# Altium project PLC1.PrjPcb (part 2 of 2)
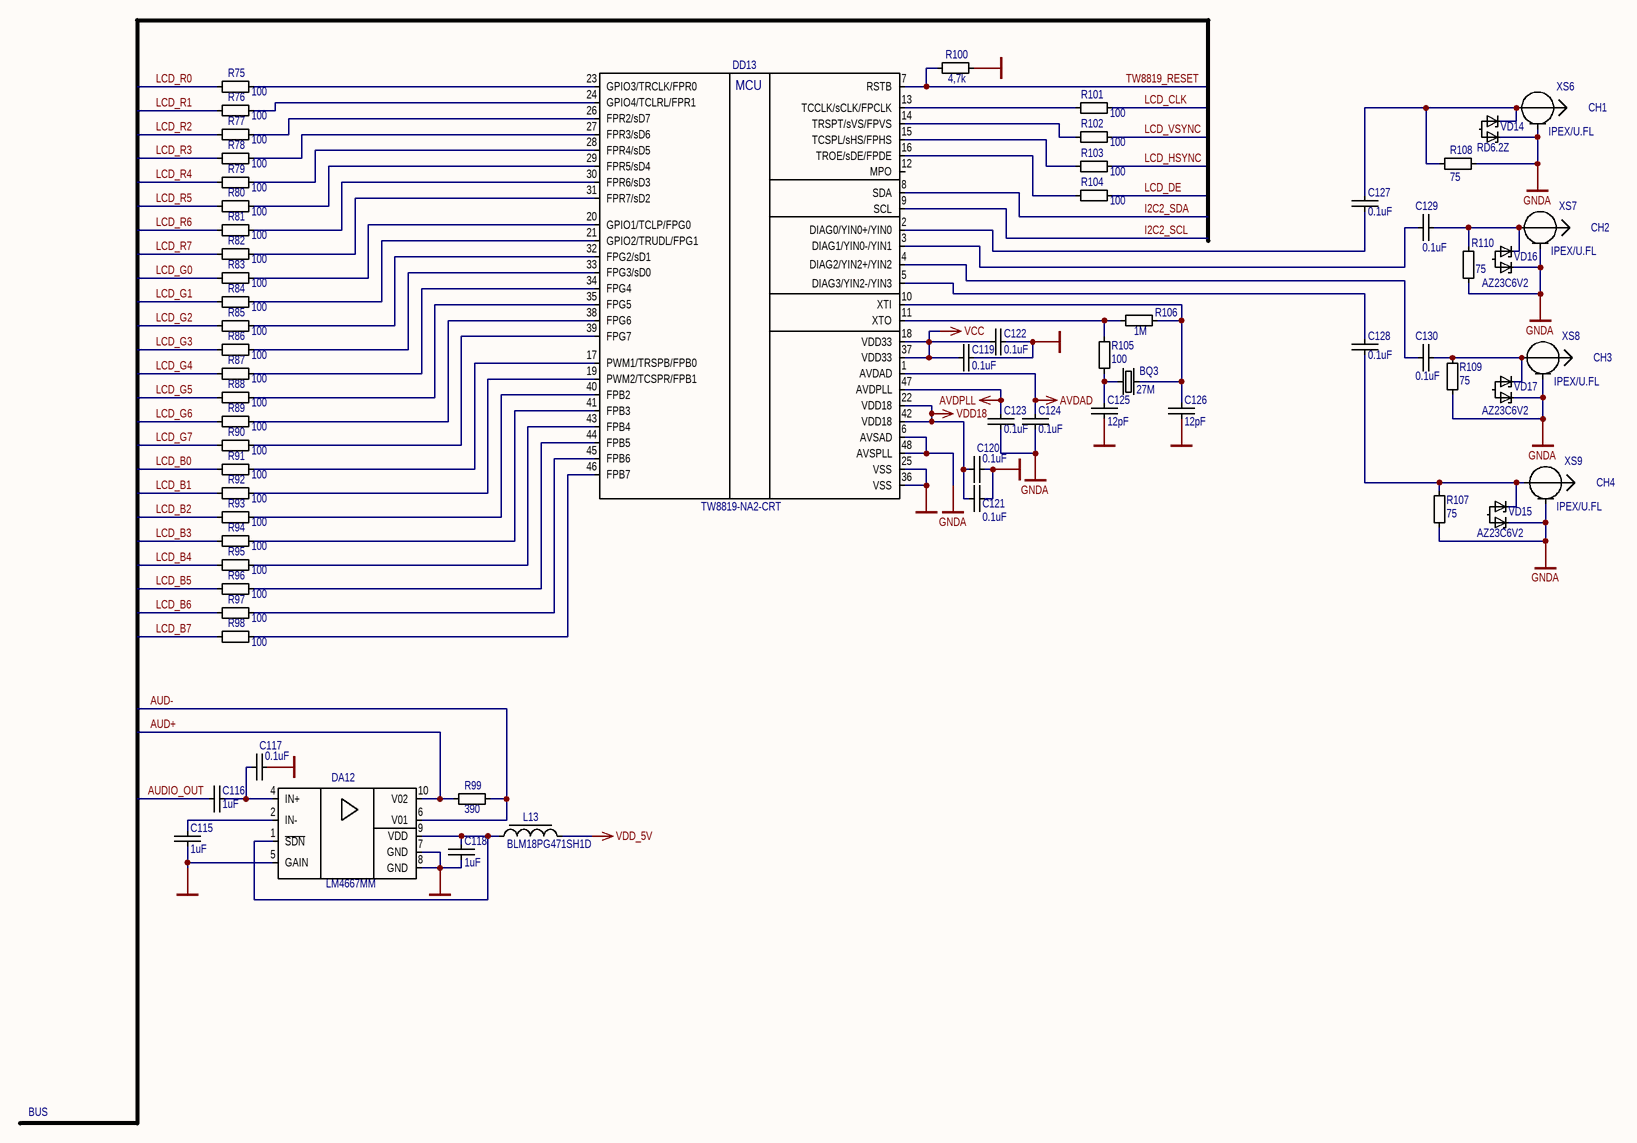
[diagram p4: PLC1_4.SchDoc]

## Nets that join several sheets
+24V: PLC1 (FU1.1), PLC1_3 (VD10.2 VD12.2 XP8.1 XP9.11)
AVDAD: PLC1 (C64.2 L9.1), PLC1_4 (C124.1 DD13.1)
AVDD_DISP: PLC1 (7 pins), PLC1_2 (C73.1 R17.1 XS2.43)
AVDPLL: PLC1 (5 pins), PLC1_4 (C123.1 DD13.47)
GND: PLC1 (89 pins), PLC1_2 (58 pins), PLC1_3 (53 pins), PLC1_4 (15 pins)
GNDA: PLC1 (6 pins), PLC1_4 (16 pins)
LCD_LUM: PLC1 (R7.1), PLC1_2 (DD1.50)
VCC: PLC1 (48 pins), PLC1_2 (45 pins), PLC1_3 (26 pins), PLC1_4 (C119.1 C122.1 DD13.18 DD13.37)
VDD18: PLC1 (C56.2 DA7.2 TP6.1), PLC1_4 (C120.1 C121.1 DD13.22 DD13.42)
VDD_5V: PLC1 (C45.2 L5.1 TP2.1), PLC1_3 (XP1.1), PLC1_4 (L13.1)
VDDA: PLC1 (C66.2 L11.1), PLC1_2 (C80.1 DD1.38 DD1.39)
VGH: PLC1 (6 pins), PLC1_2 (XS2.41)
VGL: PLC1 (C62.2 C63.2 DA8.5 TP8.1), PLC1_2 (XS2.42)
VLED+: PLC1 (C43.2 L6.1 TP3.1), PLC1_2 (C70.2 XS2.1 XS2.2)
VLED-: PLC1 (R8.2 R9.1), PLC1_2 (XS2.3 XS2.4)
1W_TEMP: PLC1_2 (DD1.107), PLC1_3 (R48.2 XP5.3)
ADC12_IN6: PLC1_2 (DD1.52), PLC1_3 (C108.2 R66.1 R69.2 VD7.3)
ADC12_IN7: PLC1_2 (DD1.53), PLC1_3 (C109.2 R65.1 R67.2 VD8.3)
AUD+: PLC1_3 (XP1.6), PLC1_4 (DA12.10 R99.2)
AUD-: PLC1_3 (XP1.5), PLC1_4 (DA12.6 R99.1)
AUDIO_OUT: PLC1_2 (DD1.51), PLC1_4 (C116.2)
CAN1_CONT: PLC1_2 (DD1.1), PLC1_3 (DD8.5)
CAN1_RX: PLC1_2 (DD1.167), PLC1_3 (DD8.4)
CAN1_TX: PLC1_2 (DD1.168), PLC1_3 (DD8.1)
CAN2_CONT: PLC1_2 (DD1.2), PLC1_3 (DD9.5)
CAN2_RX: PLC1_2 (DD1.163), PLC1_3 (DD9.1)
CAN2_TX: PLC1_2 (DD1.164), PLC1_3 (DD9.4)
COL1: PLC1_2 (DD1.57), PLC1_3 (C106.2 R59.1 XS4.5)
COL2: PLC1_2 (DD1.58), PLC1_3 (C107.2 R60.1 XS4.6)
HEAT_ON: PLC1_2 (DD1.157), PLC1_3 (R51.1)
I2C2_SCL: PLC1_2 (DD1.45 DD2.4 DD3.6 R21.1), PLC1_3 (DD11.2), PLC1_4 (DD13.9)
I2C2_SDA: PLC1_2 (DD1.46 DD2.5 DD3.5 R20.1), PLC1_3 (DD11.1), PLC1_4 (DD13.8)
LCD_B0: PLC1_2 (DD1.3 XS2.19), PLC1_4 (R91.2)
LCD_B1: PLC1_2 (DD1.155 XS2.18), PLC1_4 (R92.2)
LCD_B2: PLC1_2 (DD1.153 XS2.17), PLC1_4 (R93.2)
LCD_B3: PLC1_2 (DD1.154 XS2.16), PLC1_4 (R94.2)
LCD_B4: PLC1_2 (DD1.173 XS2.15), PLC1_4 (R95.2)
LCD_B5: PLC1_2 (DD1.174 XS2.14), PLC1_4 (R96.2)
LCD_B6: PLC1_2 (DD1.175 XS2.13), PLC1_4 (R97.2)
LCD_B7: PLC1_2 (DD1.176 XS2.12), PLC1_4 (R98.2)
LCD_CLK: PLC1_2 (DD1.111 XS2.37), PLC1_4 (R101.2)
LCD_DE: PLC1_2 (DD1.28 XS2.9), PLC1_4 (R104.2)
LCD_G0: PLC1_2 (DD1.4 XS2.27), PLC1_4 (R83.2)
LCD_G1: PLC1_2 (DD1.5 XS2.26), PLC1_4 (R84.2)
LCD_G2: PLC1_2 (DD1.128 XS2.25), PLC1_4 (R85.2)
LCD_G3: PLC1_2 (DD1.129 XS2.24), PLC1_4 (R86.2)
LCD_G4: PLC1_2 (DD1.130 XS2.23), PLC1_4 (R87.2)
LCD_G5: PLC1_2 (DD1.131 XS2.22), PLC1_4 (R88.2)
LCD_G6: PLC1_2 (DD1.132 XS2.21), PLC1_4 (R89.2)
LCD_G7: PLC1_2 (DD1.133 XS2.20), PLC1_4 (R90.2)
LCD_HSYNC: PLC1_2 (DD1.12 XS2.11), PLC1_4 (R103.2)
LCD_R0: PLC1_2 (DD1.43 XS2.35), PLC1_4 (R75.2)
LCD_R1: PLC1_2 (DD1.44 XS2.34), PLC1_4 (R76.2)
LCD_R2: PLC1_2 (DD1.85 XS2.33), PLC1_4 (R77.2)
LCD_R3: PLC1_2 (DD1.86 XS2.32), PLC1_4 (R78.2)
LCD_R4: PLC1_2 (DD1.87 XS2.31), PLC1_4 (R79.2)
LCD_R5: PLC1_2 (DD1.88 XS2.30), PLC1_4 (R80.2)
LCD_R6: PLC1_2 (DD1.89 XS2.29), PLC1_4 (R81.2)
LCD_R7: PLC1_2 (DD1.110 XS2.28), PLC1_4 (R82.2)
LCD_VSYNC: PLC1_2 (DD1.11 XS2.10), PLC1_4 (R102.2)
LEDK: PLC1_2 (DD1.134), PLC1_3 (XS4.8)
OTG_FS_DM: PLC1_2 (DD1.122), PLC1_3 (DA9.1)
OTG_FS_DP: PLC1_2 (DD1.123), PLC1_3 (DA9.3)
OUT1: PLC1_2 (DD1.83), PLC1_3 (R53.1)
OUT2: PLC1_2 (DD1.84), PLC1_3 (R54.1)
PPS_GPS: PLC1_2 (DD1.162), PLC1_3 (R64.1)
ROW1: PLC1_2 (DD1.165), PLC1_3 (R55.2)
ROW2: PLC1_2 (DD1.119), PLC1_3 (R56.2)
ROW3: PLC1_2 (DD1.120), PLC1_3 (R57.2)
ROW4: PLC1_2 (DD1.121), PLC1_3 (R58.2)
RS232_~{ON}: PLC1_2 (DD1.156), PLC1_3 (DD7.1)
RS485_CONT: PLC1_2 (DD1.101), PLC1_3 (DD10.2 DD10.3)
SW1_RS: PLC1_2 (DD1.24), PLC1_3 (DA10.2 DA10.4)
SW2_RS: PLC1_2 (DD1.25), PLC1_3 (DA11.2 DA11.4)
SWCLK: PLC1_2 (DD1.137), PLC1_3 (XP9.14)
SWDIO: PLC1_2 (DD1.124), PLC1_3 (C110.1 XP9.15)
SWO: PLC1_2 (DD1.161), PLC1_3 (XP9.16)
TW8819_RESET: PLC1_2 (DD1.56), PLC1_4 (DD13.7 R100.1)
USART2_RX: PLC1_2 (DD1.47), PLC1_3 (R63.1)
USART2_TX: PLC1_2 (DD1.42), PLC1_3 (R62.1)
USART3_RX: PLC1_2 (DD1.80), PLC1_3 (DD10.1 XP7.2)
USART3_TX: PLC1_2 (DD1.79), PLC1_3 (DD10.4 XP6.2)
USART6_RX: PLC1_2 (DD1.116), PLC1_3 (DD7.9)
USART6_TX: PLC1_2 (DD1.115), PLC1_3 (DD7.11)